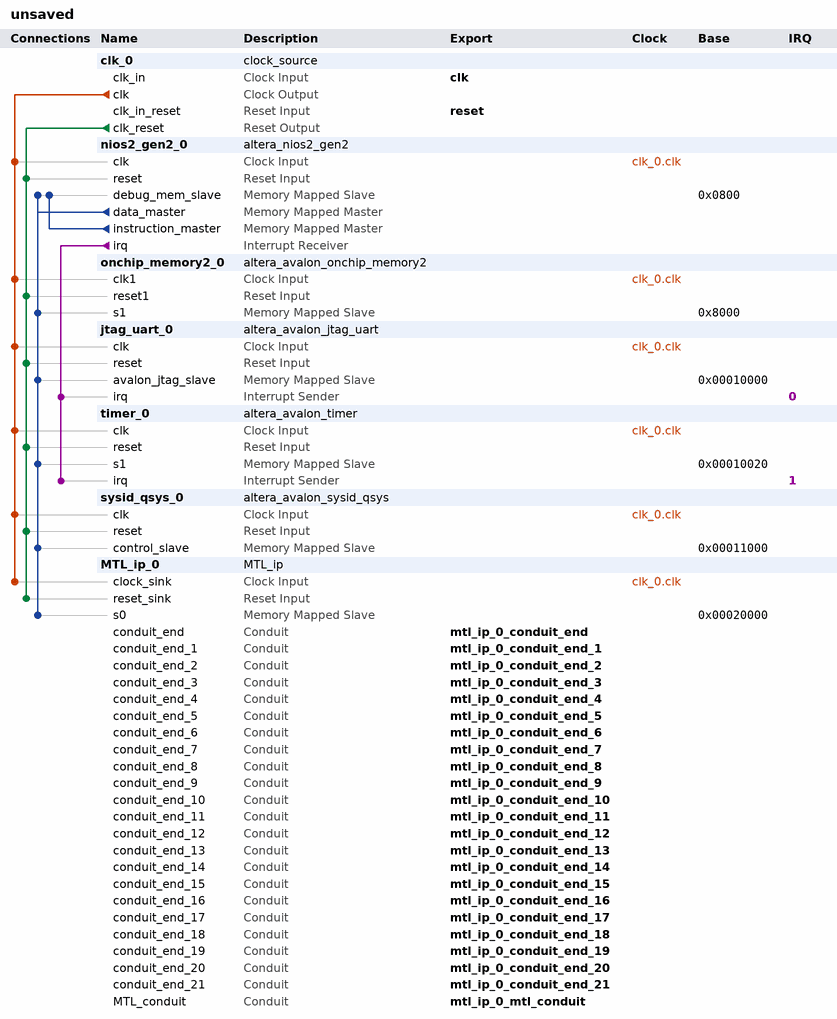
[diagram p0: system contents]
# Platform Designer (Qsys) system unsaved, Cyclone IV E EP4CE22F17C6
# Parameters at their usual value, and those the tool derives, are not listed.
package require -exact qsys 16.0
create_system unsaved
set_project_property DEVICE_FAMILY {Cyclone IV E}
set_project_property DEVICE EP4CE22F17C6

add_instance clk_0 clock_source 16.0
set_instance_parameter_value clk_0 clockFrequency 50000000

add_instance nios2_gen2_0 altera_nios2_gen2 16.0
set_instance_parameter_value nios2_gen2_0 dcache_size 2048
set_instance_parameter_value nios2_gen2_0 exceptionSlave nios2_gen2_0.debug_mem_slave
set_instance_parameter_value nios2_gen2_0 icache_size 4096
set_instance_parameter_value nios2_gen2_0 impl Tiny
set_instance_parameter_value nios2_gen2_0 resetSlave nios2_gen2_0.debug_mem_slave

add_instance onchip_memory2_0 altera_avalon_onchip_memory2 16.0
set_instance_parameter_value onchip_memory2_0 dataWidth 32
set_instance_parameter_value onchip_memory2_0 dualPort false
set_instance_parameter_value onchip_memory2_0 initMemContent true
set_instance_parameter_value onchip_memory2_0 initializationFileName onchip_mem.hex
set_instance_parameter_value onchip_memory2_0 memorySize 4096

add_instance jtag_uart_0 altera_avalon_jtag_uart 16.0
set_instance_parameter_value jtag_uart_0 simInteractiveOptions NO_INTERACTIVE_WINDOWS

add_instance timer_0 altera_avalon_timer 16.0
set_instance_parameter_value timer_0 period 1
set_instance_parameter_value timer_0 periodUnits MSEC

add_instance sysid_qsys_0 altera_avalon_sysid_qsys 16.0
set_instance_parameter_value sysid_qsys_0 id 0

add_instance MTL_ip_0 MTL_ip 1.0

# connections
add_connection clk_0.clk jtag_uart_0.clk clock
add_connection clk_0.clk MTL_ip_0.clock_sink clock
add_connection clk_0.clk nios2_gen2_0.clk clock
add_connection clk_0.clk onchip_memory2_0.clk1 clock
add_connection clk_0.clk sysid_qsys_0.clk clock
add_connection clk_0.clk timer_0.clk clock
add_connection clk_0.clk_reset jtag_uart_0.reset reset
add_connection clk_0.clk_reset MTL_ip_0.reset_sink reset
add_connection clk_0.clk_reset nios2_gen2_0.reset reset
add_connection clk_0.clk_reset onchip_memory2_0.reset1 reset
add_connection clk_0.clk_reset sysid_qsys_0.reset reset
add_connection clk_0.clk_reset timer_0.reset reset
add_connection nios2_gen2_0.data_master jtag_uart_0.avalon_jtag_slave avalon
set_connection_parameter_value nios2_gen2_0.data_master/jtag_uart_0.avalon_jtag_slave baseAddress 0x00010000
add_connection nios2_gen2_0.data_master MTL_ip_0.s0 avalon
set_connection_parameter_value nios2_gen2_0.data_master/MTL_ip_0.s0 baseAddress 0x00020000
add_connection nios2_gen2_0.data_master nios2_gen2_0.debug_mem_slave avalon
set_connection_parameter_value nios2_gen2_0.data_master/nios2_gen2_0.debug_mem_slave baseAddress 0x0800
add_connection nios2_gen2_0.data_master onchip_memory2_0.s1 avalon
set_connection_parameter_value nios2_gen2_0.data_master/onchip_memory2_0.s1 baseAddress 0x8000
add_connection nios2_gen2_0.data_master sysid_qsys_0.control_slave avalon
set_connection_parameter_value nios2_gen2_0.data_master/sysid_qsys_0.control_slave baseAddress 0x00011000
add_connection nios2_gen2_0.data_master timer_0.s1 avalon
set_connection_parameter_value nios2_gen2_0.data_master/timer_0.s1 baseAddress 0x00010020
add_connection nios2_gen2_0.instruction_master nios2_gen2_0.debug_mem_slave avalon
set_connection_parameter_value nios2_gen2_0.instruction_master/nios2_gen2_0.debug_mem_slave baseAddress 0x0800
add_connection nios2_gen2_0.irq jtag_uart_0.irq interrupt
set_connection_parameter_value nios2_gen2_0.irq/jtag_uart_0.irq irqNumber 0
add_connection nios2_gen2_0.irq timer_0.irq interrupt
set_connection_parameter_value nios2_gen2_0.irq/timer_0.irq irqNumber 1

# exported interfaces
add_interface clk clock sink
set_interface_property clk EXPORT_OF clk_0.clk_in
add_interface mtl_ip_0_conduit_end conduit end
set_interface_property mtl_ip_0_conduit_end EXPORT_OF MTL_ip_0.conduit_end
add_interface mtl_ip_0_conduit_end_1 conduit end
set_interface_property mtl_ip_0_conduit_end_1 EXPORT_OF MTL_ip_0.conduit_end_1
add_interface mtl_ip_0_conduit_end_10 conduit end
set_interface_property mtl_ip_0_conduit_end_10 EXPORT_OF MTL_ip_0.conduit_end_10
add_interface mtl_ip_0_conduit_end_11 conduit end
set_interface_property mtl_ip_0_conduit_end_11 EXPORT_OF MTL_ip_0.conduit_end_11
add_interface mtl_ip_0_conduit_end_12 conduit end
set_interface_property mtl_ip_0_conduit_end_12 EXPORT_OF MTL_ip_0.conduit_end_12
add_interface mtl_ip_0_conduit_end_13 conduit end
set_interface_property mtl_ip_0_conduit_end_13 EXPORT_OF MTL_ip_0.conduit_end_13
add_interface mtl_ip_0_conduit_end_14 conduit end
set_interface_property mtl_ip_0_conduit_end_14 EXPORT_OF MTL_ip_0.conduit_end_14
add_interface mtl_ip_0_conduit_end_15 conduit end
set_interface_property mtl_ip_0_conduit_end_15 EXPORT_OF MTL_ip_0.conduit_end_15
add_interface mtl_ip_0_conduit_end_16 conduit end
set_interface_property mtl_ip_0_conduit_end_16 EXPORT_OF MTL_ip_0.conduit_end_16
add_interface mtl_ip_0_conduit_end_17 conduit end
set_interface_property mtl_ip_0_conduit_end_17 EXPORT_OF MTL_ip_0.conduit_end_17
add_interface mtl_ip_0_conduit_end_18 conduit end
set_interface_property mtl_ip_0_conduit_end_18 EXPORT_OF MTL_ip_0.conduit_end_18
add_interface mtl_ip_0_conduit_end_19 conduit end
set_interface_property mtl_ip_0_conduit_end_19 EXPORT_OF MTL_ip_0.conduit_end_19
add_interface mtl_ip_0_conduit_end_2 conduit end
set_interface_property mtl_ip_0_conduit_end_2 EXPORT_OF MTL_ip_0.conduit_end_2
add_interface mtl_ip_0_conduit_end_20 conduit end
set_interface_property mtl_ip_0_conduit_end_20 EXPORT_OF MTL_ip_0.conduit_end_20
add_interface mtl_ip_0_conduit_end_21 conduit end
set_interface_property mtl_ip_0_conduit_end_21 EXPORT_OF MTL_ip_0.conduit_end_21
add_interface mtl_ip_0_conduit_end_3 conduit end
set_interface_property mtl_ip_0_conduit_end_3 EXPORT_OF MTL_ip_0.conduit_end_3
add_interface mtl_ip_0_conduit_end_4 conduit end
set_interface_property mtl_ip_0_conduit_end_4 EXPORT_OF MTL_ip_0.conduit_end_4
add_interface mtl_ip_0_conduit_end_5 conduit end
set_interface_property mtl_ip_0_conduit_end_5 EXPORT_OF MTL_ip_0.conduit_end_5
add_interface mtl_ip_0_conduit_end_6 conduit end
set_interface_property mtl_ip_0_conduit_end_6 EXPORT_OF MTL_ip_0.conduit_end_6
add_interface mtl_ip_0_conduit_end_7 conduit end
set_interface_property mtl_ip_0_conduit_end_7 EXPORT_OF MTL_ip_0.conduit_end_7
add_interface mtl_ip_0_conduit_end_8 conduit end
set_interface_property mtl_ip_0_conduit_end_8 EXPORT_OF MTL_ip_0.conduit_end_8
add_interface mtl_ip_0_conduit_end_9 conduit end
set_interface_property mtl_ip_0_conduit_end_9 EXPORT_OF MTL_ip_0.conduit_end_9
add_interface mtl_ip_0_mtl_conduit conduit end
set_interface_property mtl_ip_0_mtl_conduit EXPORT_OF MTL_ip_0.MTL_conduit
add_interface reset reset sink
set_interface_property reset EXPORT_OF clk_0.clk_in_reset

set_interconnect_requirement {$system} qsys_mm.clockCrossingAdapter HANDSHAKE
set_interconnect_requirement {$system} qsys_mm.enableEccProtection FALSE
set_interconnect_requirement {$system} qsys_mm.insertDefaultSlave FALSE
set_interconnect_requirement {$system} qsys_mm.maxAdditionalLatency 1

save_system unsaved.qsys
